# EAGLE board EEZ DIB AFE1 r1B5 (EAGLE 7.2.0), part 1 of 2
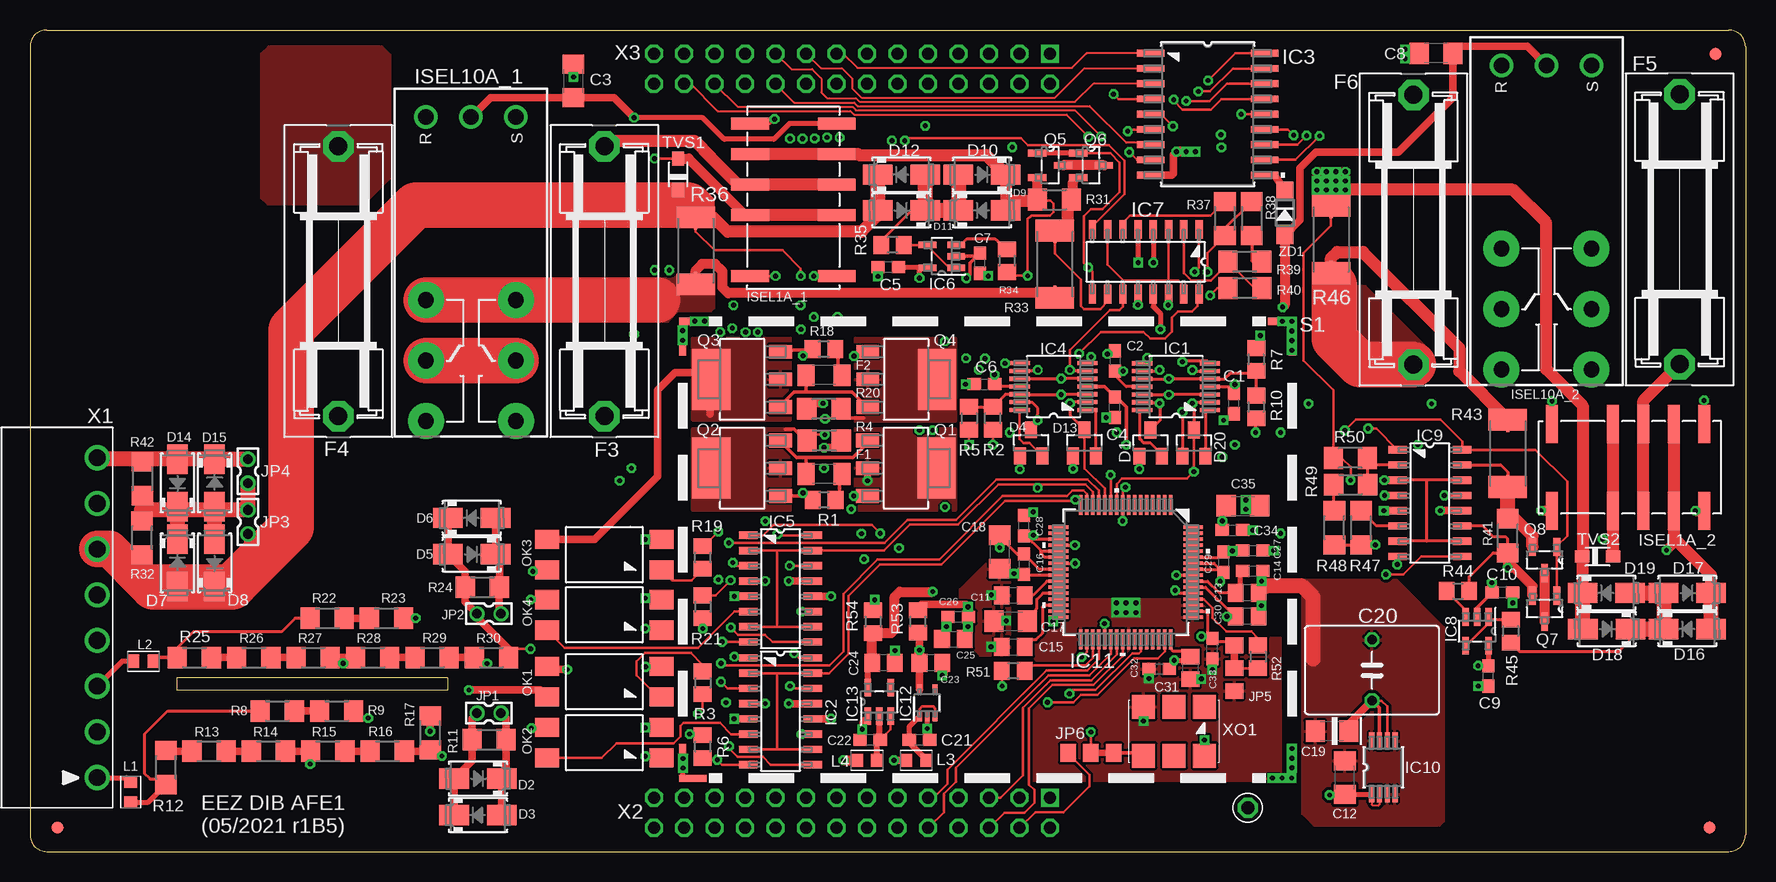
[diagram p5: board, top side]
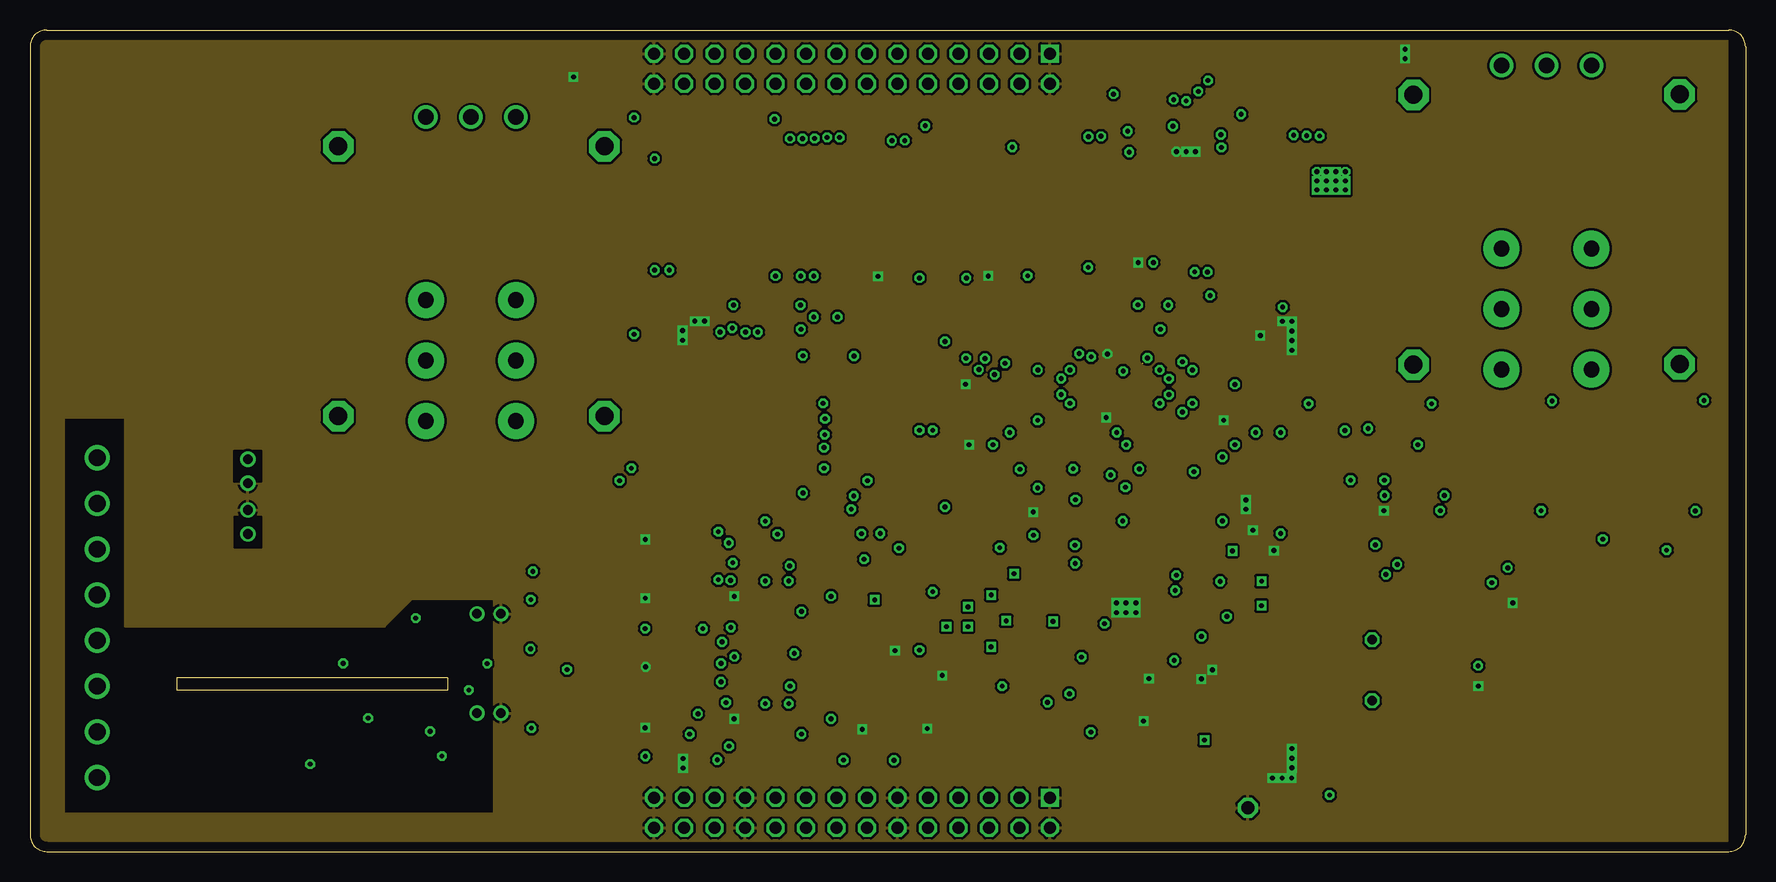
[diagram p6: board, inner layer Gnd]
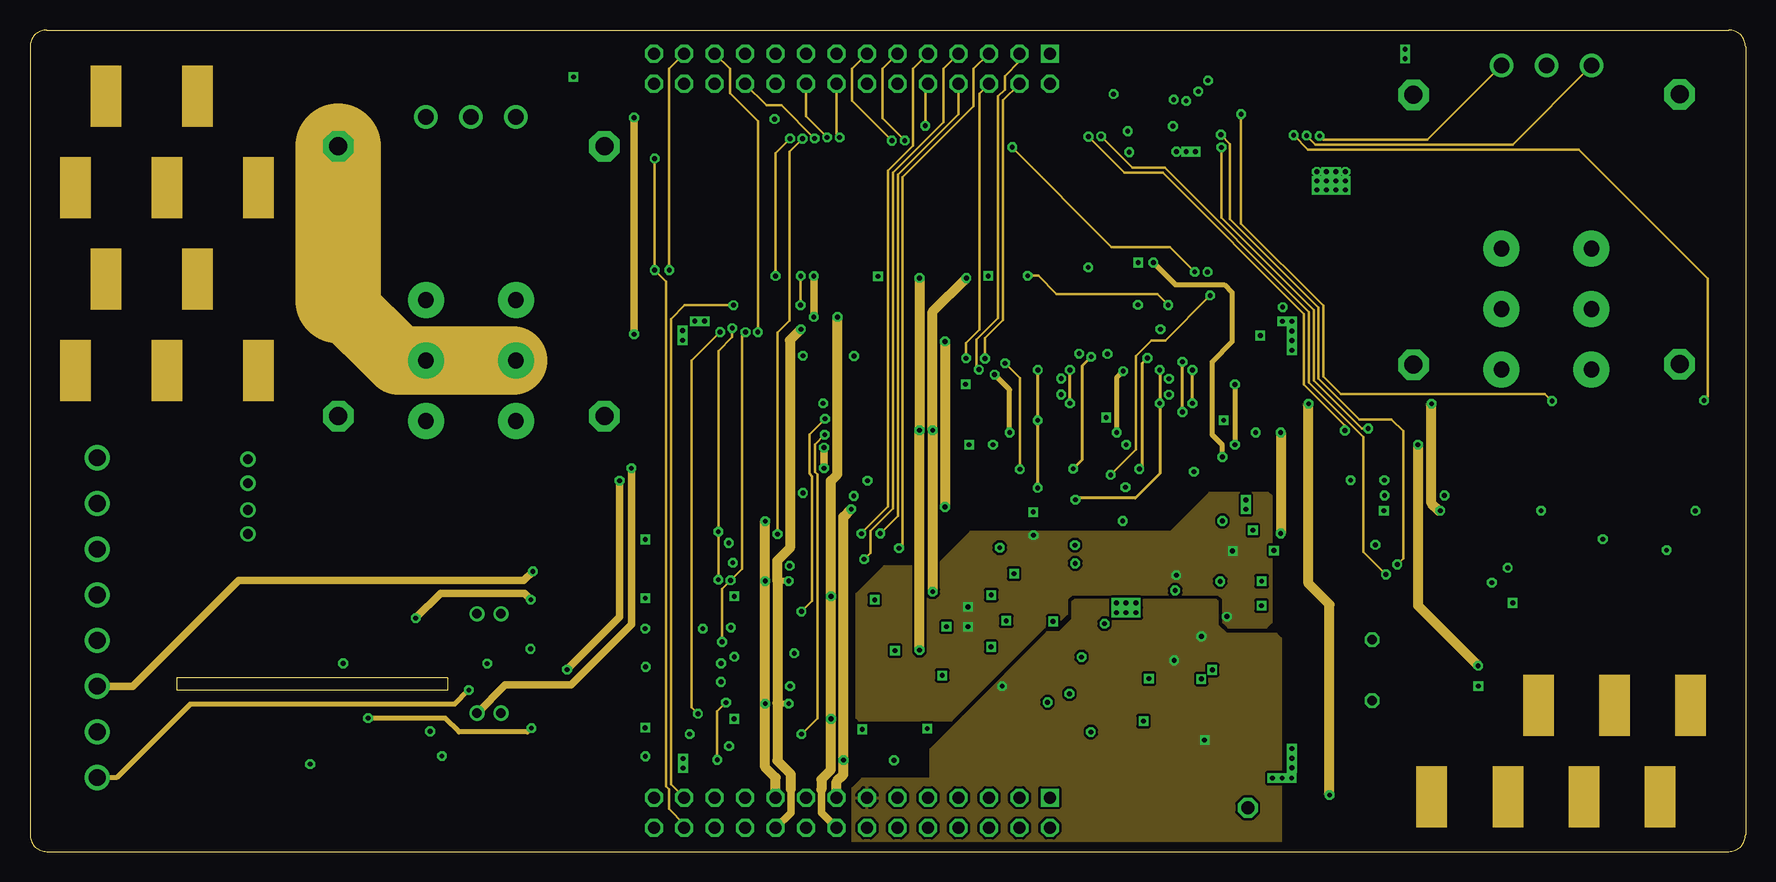
[diagram p7: board, inner layer Power]
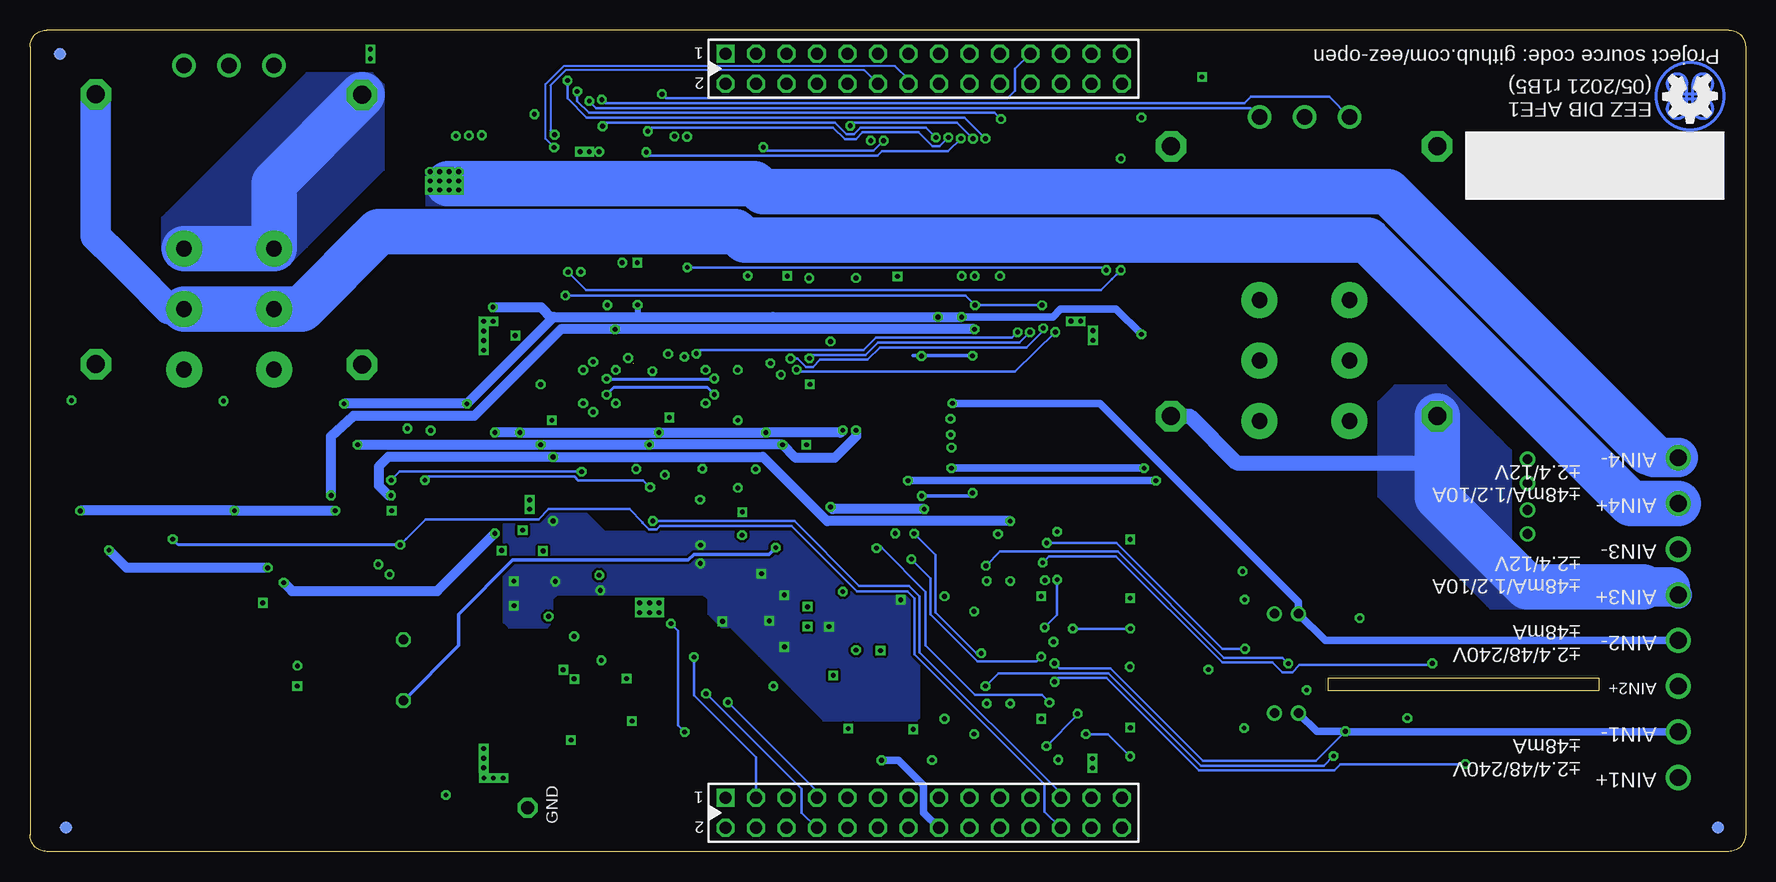
[diagram p8: board, bottom side, seen from below]

Size 143 x 68.5 mm. Coordinates in mm from the lower left corner, seen from the top.
Outline: 0,67.1 0,1.4 arc90 1.4,0 141.6,0 arc90 143,1.4 143,67.1 arc90 141.6,68.5 1.4,68.5 arc90 0,67.1
Outline: 34.8,14.46 12.24,14.46 12.24,13.45 34.8,13.45 34.8,14.46
Copper layers (1+2+15+16): Top 0.035559375mm / dielectric 7mil / Gnd 0.03048125mm / dielectric 44mil / Power 0.03048125mm / dielectric 7mil / Bottom 0.035559375mm
Design rules "DIB 4-layer *": minimum track width 6mil, minimum drill 0.3mm, track to track 4mil, track to pad 4mil, pad to pad 4mil, via to via 4mil, smd to smd 4mil, copper to edge 30mil, drill to drill 8mil, minimum pad ring 4mil, minimum via ring 8mil, stop-mask expansion 2.5mil, vias tented up to drill 0.6mm, thermal gap 8mil
Net classes: 0 default: width 0.152 mm, drill 0.3 mm, clearance 0.152 mm; 1 lvds: width 0.152 mm, drill 0.3 mm, clearance 0.152 mm to class 0, clearance 0.152 mm; 2 gnd: width 0.254 mm, drill 0.584 mm, clearance 0.254 mm; 3 diff_in: width 0.254 mm, drill 0.584 mm, clearance 0.203 mm to class 0, clearance 0.203 mm to class 1, clearance 0.203 mm to class 2, clearance 0.203 mm
vRestrict: area 0,34.5 to 21,68.5

## Footprints (pad centres in the part's own frame; a part is rotated, then mirrored left to right if it is on the bottom)
C0603 = smd 1.1 x 1: 1 -0.85,0; 2 0.85,0
C1206 = smd 1.6 x 1.8: 1 -1.4,0; 2 1.4,0
C0805 = smd 1.3 x 1.5: 1 -0.95,0; 2 0.95,0
EC1206 = smd 1.6 x 1.8: + -1.4,0; - 1.4,0
C050-075X110 = drill 0.813 octagon: 1 -2.54,0; 2 2.54,0
SOT23 = smd 1 x 1.4: 1 -0.95,-1.1; 2 0.95,-1.1; 3 0,1.1
SMA_NARROW = smd 2.464 x 1.702: 1 -1.981,0; 2 1.981,0
C1206-HV = smd 1.4 x 1.8: 1 -1.5,0; 2 1.5,0
ZH32 = drill 1.5 pad 2.54 octagon: 1 -11.25,0; 2 11.25,0
FIDUCIAL_DUAL = smd 1.016 x 1.016 bottom: B 0,0 | smd 1.016 x 1.016: T 0,0
PCB_SHIELD_TAB = drill 1.1 octagon: 1 0,0
PW(R-PDSO-G14) = smd 1.676 x 0.356: 1 -2.819,1.95; 2 -2.819,1.3; 3 -2.819,0.65; 4 -2.819,0; 5 -2.819,-0.65; 6 -2.819,-1.3; 7 -2.819,-1.95; 8 2.819,-1.95; 9 2.819,-1.3; 10 2.819,-0.65; 11 2.819,0; 12 2.819,0.65; 13 2.819,1.3; 14 2.819,1.95
SO16 = smd 1.549 x 0.61: 1 -2.692,4.445; 2 -2.692,3.175; 3 -2.692,1.905; 4 -2.692,0.635; 5 -2.692,-0.635; 6 -2.692,-1.905; 7 -2.692,-3.175; 8 -2.692,-4.445; 9 2.692,-4.445; 10 2.692,-3.175; 11 2.692,-1.905; 12 2.692,-0.635; 13 2.692,0.635; 14 2.692,1.905; 15 2.692,3.175; 16 2.692,4.445
DW18_TEX-M = smd 2.286 x 0.559: 1 -4.737,5.08; 2 -4.737,3.81; 3 -4.737,2.54; 4 -4.737,1.27; 5 -4.737,0; 6 -4.737,-1.27; 7 -4.737,-2.54; 8 -4.737,-3.81; 9 -4.737,-5.08; 10 4.737,-5.08; 11 4.737,-3.81; 12 4.737,-2.54; 13 4.737,-1.27; 14 4.737,0; 15 4.737,1.27; 16 4.737,2.54; 17 4.737,3.81; 18 4.737,5.08
DBV5 = smd 1.473 x 0.559: 1 -1.194,0.95; 2 -1.194,0; 3 -1.194,-0.95; 4 1.194,-0.95; 5 1.194,0.95
MSOP-8_MS_LIT = smd 1.359 x 0.432: 1 -2.229,0.975; 2 -2.229,0.325; 3 -2.229,-0.325; 4 -2.229,-0.975; 5 2.229,-0.975; 6 2.229,-0.325; 7 2.229,0.325; 8 2.229,0.975
PAG64 = smd 1.664 x 0.279: 1 -5.62,3.75; 2 -5.62,3.25; 3 -5.62,2.75; 4 -5.62,2.25; 5 -5.62,1.75; 6 -5.62,1.25; 7 -5.62,0.75; 8 -5.62,0.25; 9 -5.62,-0.25; 10 -5.62,-0.75; 11 -5.62,-1.25; 12 -5.62,-1.75; 13 -5.62,-2.25; 14 -5.62,-2.75; 15 -5.62,-3.25; 16 -5.62,-3.75; 33 5.62,-3.75; 34 5.62,-3.25; 35 5.62,-2.75; 36 5.62,-2.25; 37 5.62,-1.75; 38 5.62,-1.25; 39 5.62,-0.75; 40 5.62,-0.25; 41 5.62,0.25; 42 5.62,0.75; 43 5.62,1.25; 44 5.62,1.75; 45 5.62,2.25; 46 5.62,2.75; 47 5.62,3.25; 48 5.62,3.75 | smd 0.279 x 1.664: 17 -3.75,-5.62; 18 -3.25,-5.62; 19 -2.75,-5.62; 20 -2.25,-5.62; 21 -1.75,-5.62; 22 -1.25,-5.62; 23 -0.75,-5.62; 24 -0.25,-5.62; 25 0.25,-5.62; 26 0.75,-5.62; 27 1.25,-5.62; 28 1.75,-5.62; 29 2.25,-5.62; 30 2.75,-5.62; 31 3.25,-5.62; 32 3.75,-5.62; 49 3.75,5.62; 50 3.25,5.62; 51 2.75,5.62; 52 2.25,5.62; 53 1.75,5.62; 54 1.25,5.62; 55 0.75,5.62; 56 0.25,5.62; 57 -0.25,5.62; 58 -0.75,5.62; 59 -1.25,5.62; 60 -1.75,5.62; 61 -2.25,5.62; 62 -2.75,5.62; 63 -3.25,5.62; 64 -3.75,5.62
DCK5 = smd 0.85 x 0.4: 1 -1.125,0.65; 2 -1.125,0; 3 -1.125,-0.65; 4 1.125,-0.65; 5 1.125,0.65
G6SK-2F = smd 1 x 3.16: 1 -6.35,-3.62; 3 -1.27,-3.62; 4 1.27,-3.62; 5 3.81,-3.62; 6 6.35,-3.62; 7 6.35,3.62; 8 3.81,3.62; 9 1.27,3.62; 10 -1.27,3.62; 12 -6.35,3.62
RT424FXX = drill 1.3 pad 3: 11 20.3,-3.75; 12 15.26,-3.75; 14 25.34,-3.75; 21 20.3,3.75; 22 15.26,3.75; 24 25.34,3.75 | drill 1.3: A1 0,-3.75; A2 0,3.75; A3 0,0
2MM-2 = drill 0.8 pad 1.27: 1 0,-1; 2 0,1
JP3-0805-CUT2 = smd 1.3 x 1.5: COM 0,0; NC 1.9,0; NO -1.9,0
BEAD0603 = smd 1 x 1.1: P$1 -0.85,0; P$2 0.85,0
DIL4-SMD = smd 1.6 x 2: 1 -1.27,-4.77; 2 1.27,-4.77; 3 1.27,4.77; 4 -1.27,4.77
SOT230P700X180-4N = smd 1.905 x 1.143: 1 -3.2,2.311; 2 -3.2,0; 3 -3.2,-2.311 | smd 3.175 x 5.08: 4 2.565,0
SOT103P240X110-3N = smd 1.524 x 0.559: 1 -1.079,1.016; 2 -1.079,-1.016; 3 1.079,0
R0805 = smd 1.3 x 1.5: 1 -0.95,0; 2 0.95,0
R1206 = smd 1.6 x 1.803: 1 -1.422,0; 2 1.422,0
R_2512-4WIRE = smd 1.8 x 3.2: 1 -2.8,0; 2 2.8,0 | smd 1.27 x 0.254: 1S -2.413,0; 2S 2.413,0
2118732-2 = smd 2.3 x 0.6: SH.1 50.35,38.5; SH.2 50.35,0.4; SH.5 1.25,0.4 | smd 0.6 x 2.35: SH.3 51.2,2.075; SH.4 51.2,36.825; SH.6 0.4,2.075; SH.7 0.4,36.825 | smd 2.35 x 0.6: SH.8 1.275,38.5
SOD323-BIDIR = smd 1.2 x 1: C1 -1.3,0; C2 1.3,0
691322310008 = drill 1.4: 1 -13.335,0; 2 -9.525,0; 3 -5.715,0; 4 -1.905,0; 5 1.905,0; 6 5.715,0; 7 9.525,0; 8 13.335,0
TSW-114-07-F-D = drill 1 pad 1.5 square: 1 33.02,0 | drill 1 pad 1.5 octagon: 2 33.02,2.54; 3 30.48,0; 4 30.48,2.54; 5 27.94,0; 6 27.94,2.54; 7 25.4,0; 8 25.4,2.54; 9 22.86,0; 10 22.86,2.54; 11 20.32,0; 12 20.32,2.54; 13 17.78,0; 14 17.78,2.54; 15 15.24,0; 16 15.24,2.54; 17 12.7,0; 18 12.7,2.54; 19 10.16,0; 20 10.16,2.54; 21 7.62,0; 22 7.62,2.54; 23 5.08,0; 24 5.08,2.54; 25 2.54,0; 26 2.54,2.54; 27 0,0; 28 0,2.54
XLH = smd 1.9 x 2: 1 -2.54,-2.05; 2 0,-2.05; 3 2.54,-2.05; 4 2.54,2.05; 5 0,2.05; 6 -2.54,2.05
SOD123 = smd 1.4 x 1.4: A 1.9,0; C -1.9,0

## Placement (x,y rotation side)
C1  100n  [C0603]  100.37,37.35 90 top
C2  100n  [C0603]  90.42,40.9 270 top
C3  10u  [C1206]  45.3,64.25 90 top
C4  100n  [C0603]  90.42,37.04 90 top
C5  100n  [C0603]  71.54,48.74 0 top
C6  100n  [C0603]  79.57,38.96 0 top
C7  100n  [C0603]  79.2,49.06 90 top
C8  10u  [C1206]  117.2,66.56 180 top
C9  100n  [C0603]  121.58,14.64 90 top
C10  100n  [C0603]  122.73,21.59 180 top
C11  1u  [C0805]  81.97,21.37 0 top
C12  N.C.  [C1206]  109.6,6.17 90 top
C13  1u  [C0805]  101.46,21.55 180 top
C14  100n  [C0603]  101.93,23.39 0 top
C15  1u  [C0805]  81.97,17.05 0 top
C16  100n  [C0603]  82.85,23.96 270 top
C17  22u  [C1206]  81.75,19.21 0 top
C18  10u  [C1206]  80.82,24.98 270 top
C19  N.C.  [EC1206]  108.53,10.03 180 top
C20  N.C.  [C050-075X110]  111.87,15.12 90 top
C21  100n  [C0603]  74.14,9.32 0 top
C22  100n  [C0603]  70.03,9.31 180 top
C23  1u  [C0805]  75.1,15.73 180 top
C24  1u  [C0805]  71.15,15.73 180 top
C25  1u  [C0805]  76.97,17.71 0 top
C26  100n  [C0603]  77.38,19.55 180 top
C27  100n  [C0603]  101.93,25.09 0 top
C28  100n  [C0603]  82.85,27.16 90 top
C29  100n  [C0603]  99.47,24.13 270 top
C30  1u  [C0805]  101.46,19.59 180 top
C31  1u  [C0805]  96.71,15.31 270 top
C32  100n  [C0603]  94.12,15.22 0 top
C33  100n  [C0603]  98.55,16.91 90 top
C34  100n  [C0603]  100.23,26.79 0 top
C35  10u  [C1206]  101.1,28.83 0 top
D1  BAV199,235  [SOT23]  93.41,34.06 0 top
D2  SA2M-E3/61T  [SMA_NARROW]  37.34,6.08 180 top
D3  SA2M-E3/61T  [SMA_NARROW]  37.34,3.03 0 top
D4  BAV199,235  [SOT23]  83.45,34.07 0 top
D5  SA2M-E3/61T  [SMA_NARROW]  36.83,24.77 180 top
D6  SA2M-E3/61T  [SMA_NARROW]  36.83,27.81 0 top
D7  SA2M-E3/61T  [SMA_NARROW]  12.29,24.06 270 top
D8  SA2M-E3/61T  [SMA_NARROW]  15.39,24.06 90 top
D9  SA2M-E3/61T  [SMA_NARROW]  79.36,53.45 0 top
D10  SA2M-E3/61T  [SMA_NARROW]  79.36,56.44 180 top
D11  SA2M-E3/61T  [SMA_NARROW]  72.63,53.45 180 top
D12  SA2M-E3/61T  [SMA_NARROW]  72.63,56.44 0 top
D13  BAV199,235  [SOT23]  87.9,34.07 0 top
D14  SA2M-E3/61T  [SMA_NARROW]  12.29,30.74 90 top
D15  SA2M-E3/61T  [SMA_NARROW]  15.39,30.74 270 top
D16  SA2M-E3/61T  [SMA_NARROW]  138.15,18.55 0 top
D17  SA2M-E3/61T  [SMA_NARROW]  138.15,21.56 180 top
D18  SA2M-E3/61T  [SMA_NARROW]  131.42,18.55 180 top
D19  SA2M-E3/61T  [SMA_NARROW]  131.41,21.56 0 top
D20  BAV199,235  [SOT23]  97.03,34.06 0 top
EEZ_SIGNATURE  SIGNATURESMALL  [SIGNATURE_5MM]  4.63,62.98 180 top
F1  SN005-60  [C1206-HV]  66.19,31.48 180 top
F2  SN005-60  [C1206-HV]  66.18,39.72 180 top
F3  ZH32 (1.25A)  [ZH32]  47.88,47.56 270 top
F4  ZH32 (10A)  [ZH32]  25.7,47.56 270 top
F5  ZH32 (1.25A)  [ZH32]  137.52,51.88 90 top
F6  ZH32 (10A)  [ZH32]  115.32,51.84 270 top
FM1  FIDUCIAL_2  [FIDUCIAL_DUAL]  2.3,2 0 top
FM2  FIDUCIAL_2  [FIDUCIAL_DUAL]  140.5,66.5 0 top
FM3  FIDUCIAL_2  [FIDUCIAL_DUAL]  140,2 0 top
GND  [PCB_SHIELD_TAB]  101.51,3.64 0 top
IC1  MCP6004T-I/ST  [PW(R-PDSO-G14)]  95.53,38.76 180 top
IC2  DG212BDY-T1-E3  [SO16]  62.56,11.69 0 top
IC3  ULN2803ADWR  [DW18_TEX-M]  98.17,61.48 0 top
IC4  MCP6004T-I/ST  [PW(R-PDSO-G14)]  85.32,38.77 180 top
IC5  DG212BDY-T1-E3  [SO16]  62.56,21.92 0 top
IC6  TLV9001IDBVR  [DBV5]  76.01,49.63 180 top
IC7  DG212BDY-T1-E3  [SO16]  93,49.17 270 top
IC8  TLV9001IDBVR  [DBV5]  120.62,18.37 270 top
IC9  DG212BDY-T1-E3  [SO16]  116.69,29.05 0 top
IC10  N.C.  [MSOP-8_MS_LIT]  112.81,7.02 90 top
IC11  ADS131E04IPAGR  [PAG64]  91.34,23.29 270 top
IC12  TPS71725DCKR  [DCK5]  74.79,12.39 90 top
IC13  TPS72325DBVR  [DBV5]  70.79,12.48 90 top
ISEL1A_1  EE2-5TNU-L  [G6SK-2F]  63.63,54.34 90 top
ISEL1A_2  EE2-5TNU-L  [G6SK-2F]  133.22,32.03 0 top
ISEL10A_1  RT424F05  [RT424FXX]  36.77,61.24 270 top
ISEL10A_2  RT424F05  [RT424FXX]  126.42,65.53 270 top
JP1  DS1025-01-1*2P8BV1-B  [2MM-2]  38.27,11.54 270 top
JP2  DS1025-01-1*2P8BV1-B  [2MM-2]  38.27,19.82 270 top
JP3  DS1025-01-1*2P8BV1-B  [2MM-2]  18.16,27.48 0 top
JP4  DS1025-01-1*2P8BV1-B  [2MM-2]  18.16,31.71 180 top
JP5  JP3-CUT-0805-ROTATED  [JP3-0805-CUT2]  100.39,15.29 90 top
JP6  JP3-CUT-0805-ROTATED  [JP3-0805-CUT2]  88.43,8.23 0 top
L1  MLZ1608N100LT000  [BEAD0603]  8.41,4.96 90 top
L2  MLZ1608N100LT000  [BEAD0603]  9.46,15.87 180 top
L3  BLM18AG102SH1D  [BEAD0603]  73.88,7.6 180 top
L4  BLM18AG102SH1D  [BEAD0603]  69.77,7.6 180 top
OK1  VOR1142B4  [DIL4-SMD]  47.88,14.16 90 top
OK2  VOR1142B4  [DIL4-SMD]  47.88,9.08 90 top
OK3  VOR1142B4  [DIL4-SMD]  47.88,24.75 90 top
OK4  VOR1142B4  [DIL4-SMD]  47.88,19.73 90 top
Q1  CPC3902ZTR  [SOT230P700X180-4N]  73.01,31.96 0 top
Q2  CPC3902ZTR  [SOT230P700X180-4N]  59.36,31.96 180 top
Q3  CPC3902ZTR  [SOT230P700X180-4N]  59.36,39.37 180 top
Q4  CPC3902ZTR  [SOT230P700X180-4N]  73.04,39.37 0 top
Q5  BSS214NH6327XTSA1  [SOT103P240X110-3N]  85.04,57.21 0 top
Q6  BSS214NH6327XTSA1  [SOT103P240X110-3N]  88.44,57.21 0 top
Q7  BSS214NH6327XTSA1  [SOT103P240X110-3N]  126.25,20.25 270 top
Q8  BSS214NH6327XTSA1  [SOT103P240X110-3N]  126.25,24.32 270 top
R1  10R  [R0805]  66.19,29.32 180 top
R2  330R  [R0805]  80.25,36.13 90 top
R3  470R  [R0805]  56.08,14.07 270 top
R4  33R 0.1%  [R1206]  66.21,34.27 180 top
R5  10K  [R0805]  78.28,36.13 270 top
R6  470R  [R0805]  56.08,8.75 90 top
R7  10K  [R0805]  102.21,41.03 270 top
R8  49K9  [R1206]  20.61,11.72 180 top
R9  49K9  [R1206]  25.57,11.72 180 top
R10  330R  [R0805]  102.21,37.07 270 top
R11  100K  [R1206]  38.27,9.33 180 top
R12  4M7 0.1%  [R1206]  11.34,7.01 270 top
R13  4M7 0.1%  [R1206]  14.92,8.37 180 top
R14  100K 0.1%  [R1206]  19.88,8.37 180 top
R15  200K 0.1%  [R1206]  24.83,8.37 180 top
R16  200K 0.1%  [R1206]  29.78,8.37 180 top
R17  100K 0.1%  [R1206]  33.36,9.89 270 top
R18  10R  [R0805]  66.18,41.88 180 top
R19  470R  [R0805]  56.08,24.52 90 top
R20  33R 0.1%  [R1206]  66.18,36.9 0 top
R21  470R  [R0805]  56.08,20.41 270 top
R22  49K9  [R1206]  24.78,19.45 180 top
R23  49K9  [R1206]  29.72,19.45 180 top
R24  100K  [R1206]  37.71,22.04 180 top
R25  4M7 0.1%  [R1206]  13.7,16.18 180 top
R26  4M7 0.1%  [R1206]  18.66,16.18 180 top
R27  100K 0.1%  [R1206]  23.61,16.18 180 top
R28  200K 0.1%  [R1206]  28.56,16.18 180 top
R29  200K 0.1%  [R1206]  33.52,16.18 180 top
R30  100K 0.1%  [R1206]  38.47,16.18 180 top
R31  20R  [R1206]  85.39,54.35 180 top
R32  100K  [R1206]  9.35,26.15 270 top
R33  GMR100HTBFIR022  [R_2512-4WIRE]  85.43,48.97 90 top
R34  10K  [R0805]  81.43,49.26 270 top
R35  1K  [R0805]  71.89,50.58 180 top
R36  GMR100HTBFA10L0  [R_2512-4WIRE]  55.49,50.09 270 top
R37  100K  [R1206]  99.61,52.78 270 top
R38  200K 0.1%  [R1206]  101.84,52.78 90 top
R39  200K 0.1%  [R1206]  101.27,49.18 0 top
R40  100K 0.1%  [R1206]  101.27,46.97 0 top
R41  20R  [R1206]  123.18,26.32 270 top
R42  100K  [R1206]  9.36,31.09 90 top
R43  GMR100HTBFIR022  [R_2512-4WIRE]  123.18,33.19 270 top
R44  10K  [R0805]  119.02,21.71 0 top
R45  1K  [R0805]  123.42,18.37 270 top
R46  GMR100HTBFA10L0  [R_2512-4WIRE]  108.46,51.03 270 top
R47  100K  [R1206]  110.95,27 270 top
R48  200K 0.1%  [R1206]  108.72,27 270 top
R49  200K 0.1%  [R1206]  110.08,30.59 180 top
R50  100K 0.1%  [R1206]  110.06,32.81 0 top
R51  10K  [R0805]  81.97,15.07 180 top
R52  10K  [R0805]  102.37,16.24 270 top
R53  10R  [R0805]  74.02,19.19 90 top
R54  10R  [R0805]  70.27,19.17 270 top
S1  N.C.  [2118732-2]  54,5.71 0 top
TVS1  PESD12VL1BA,115  [SOD323-BIDIR]  54.03,56.47 90 top
TVS2  PESD12VL1BA,115  [SOD323-BIDIR]  130.67,24.6 0 top
X1  691322310008  [691322310008]  5.6,19.5 90 top
X2  DS1023-2*14S21  [TSW-114-07-F-D]  52,4.5 180 bottom
X3  DS1023-2*14S21  [TSW-114-07-F-D]  52,66.54 180 bottom
XO1  N.C.  [XLH]  95.36,10.03 180 top
ZD1  MMSZ5230BT1G  [SOD123]  104.6,53.26 270 top